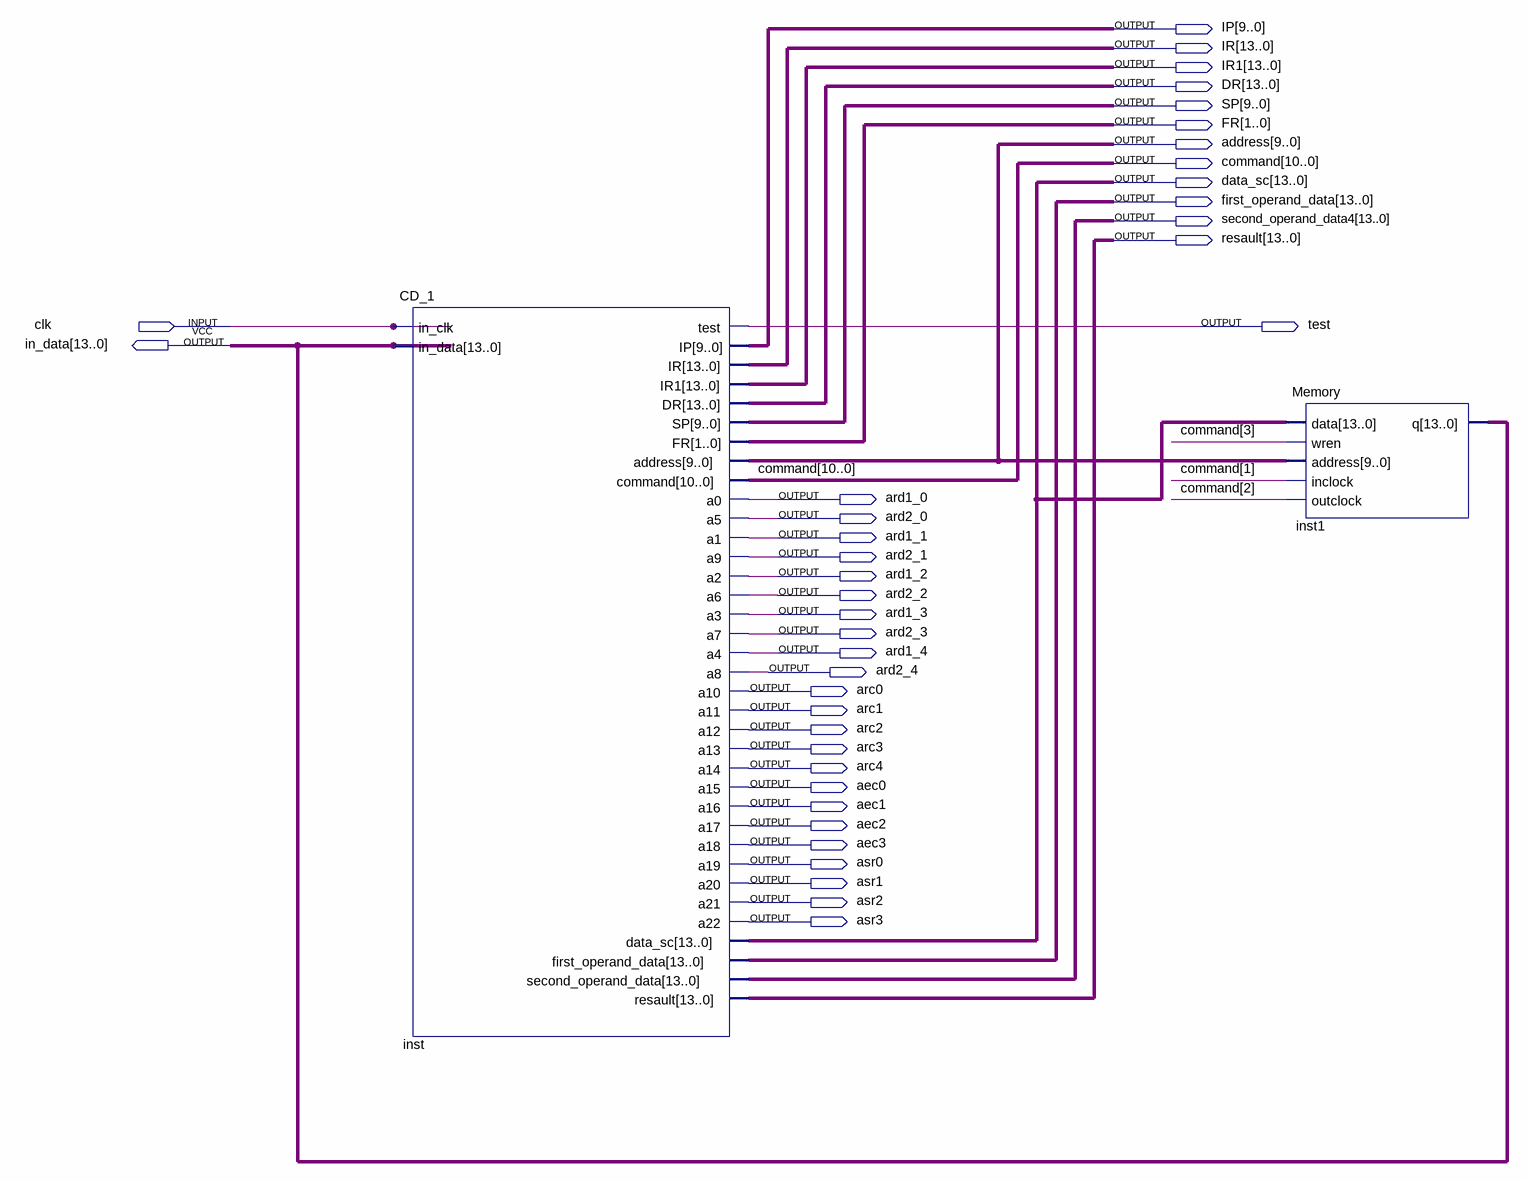
[diagram p0: schematic sheet]
// Quartus schematic CD_test.bdf as structural Verilog: 2 symbols, 38 pins
module CD_test (
  input  clk,
  output [9:0] IP,
  output [13:0] IR,
  output [13:0] IR1,
  output [13:0] DR,
  output [9:0] SP,
  output [1:0] FR,
  output [9:0] address,
  output [10:0] command,
  output [13:0] data_sc,
  output [13:0] first_operand_data,
  output [13:0] second_operand_data4,
  output [13:0] resault,
  output test,
  output [13:0] in_data,
  output ard1_0,
  output ard2_0,
  output ard1_1,
  output ard2_1,
  output ard1_2,
  output ard2_2,
  output ard1_3,
  output ard2_3,
  output ard1_4,
  output ard2_4,
  output arc0,
  output arc1,
  output arc2,
  output arc3,
  output arc4,
  output aec0,
  output aec1,
  output aec2,
  output aec3,
  output asr0,
  output asr1,
  output asr2,
  output asr3
);

  CD_1 inst (
    .in_clk(clk), .in_data(in_data), .test(test), .IP(IP), .IR(IR), .IR1(IR1), .DR(DR), .SP(SP), .FR(FR),
    .address(address), .command(command), .a0(ard1_0), .a5(ard2_0), .a1(ard1_1), .a9(ard2_1), .a2(ard1_2),
    .a6(ard2_2), .a3(ard1_3), .a7(ard2_3), .a4(ard1_4), .a8(ard2_4), .a10(arc0), .a11(arc1), .a12(arc2),
    .a13(arc3), .a14(arc4), .a15(aec0), .a16(aec1), .a17(aec2), .a18(aec3), .a19(asr0), .a20(asr1),
    .a21(asr2), .a22(asr3), .data_sc(data_sc), .first_operand_data(first_operand_data),
    .second_operand_data(second_operand_data4), .resault(resault));
  Memory inst1 (
    .data(data_sc), .wren(command[3]), .address(address), .inclock(command[1]), .outclock(command[2]),
    .q(in_data));
endmodule
